# EAGLE design v7Ardustat_details (EAGLE 5.11)
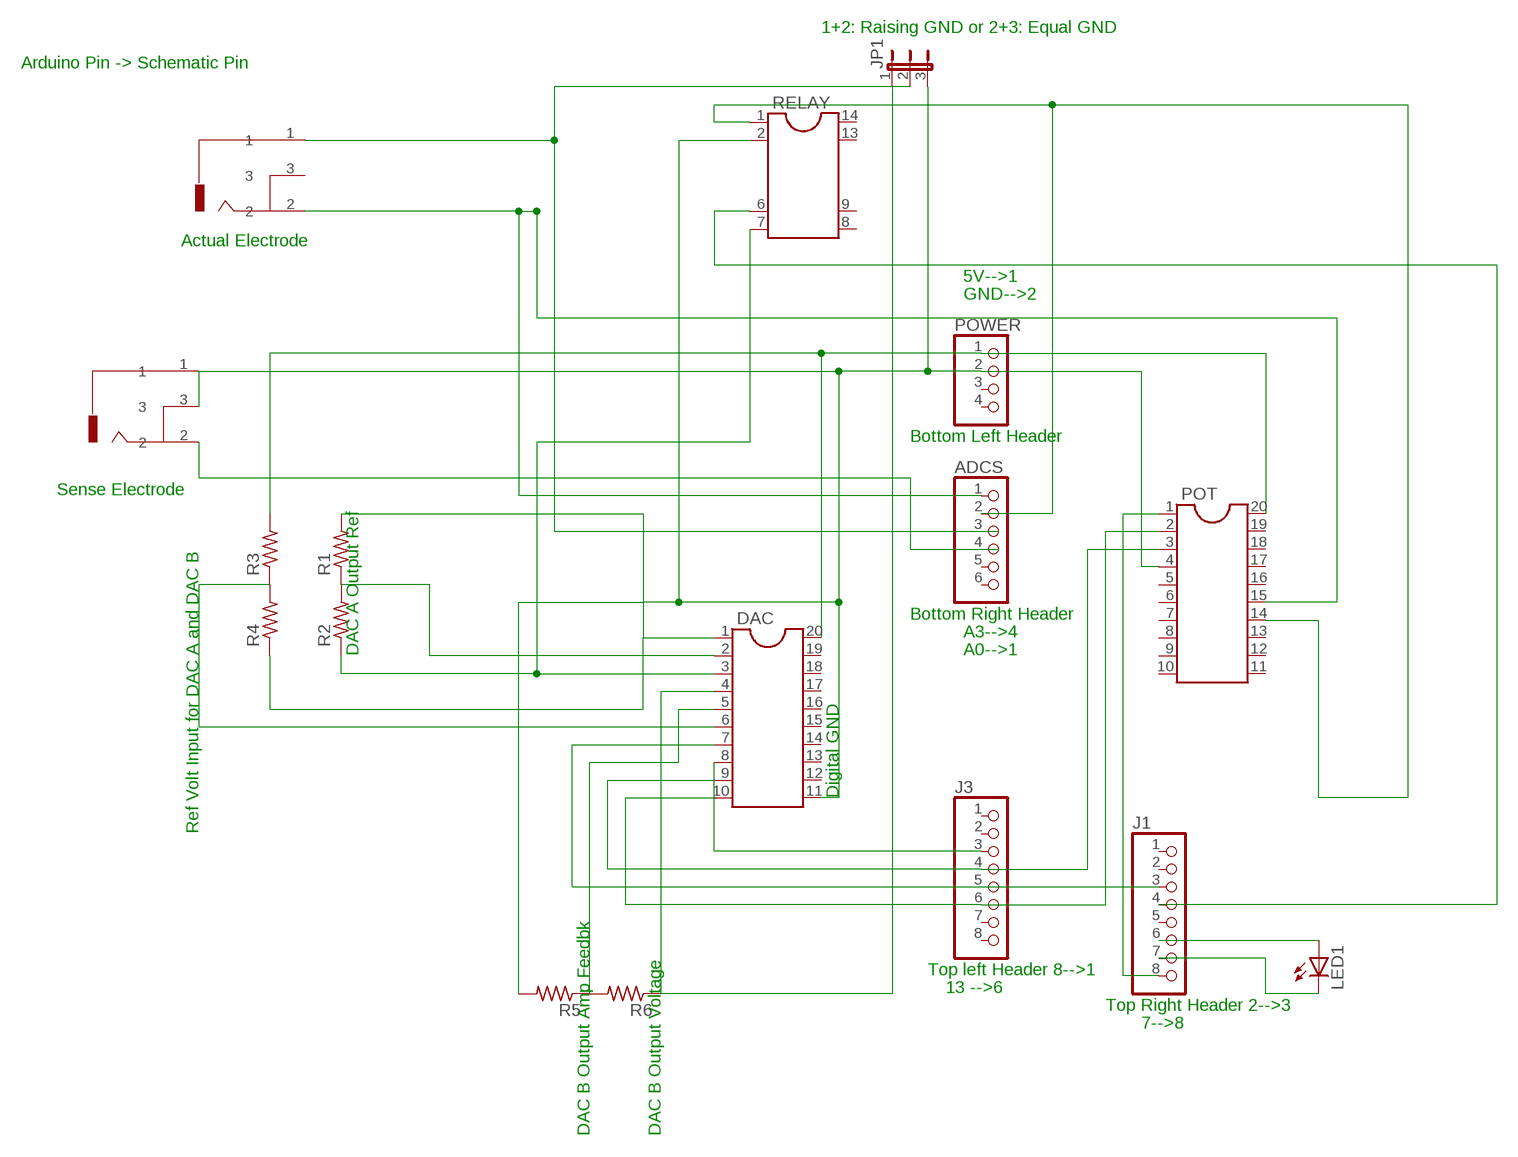
[diagram p0: schematic, sheet 1]

## Parts
ADCS  PINHD-1X6  [1X06]
DAC  DIL20S  [SOCKED-20]
J1  PINHD-1X8  [1X08]
J3  PINHD-1X8  [1X08]
JP1  JP2E  [JP2]
LED1  LED5MM  [LED5MM]
MJ-2506N1  MJ-2506N  [MJ-2506N]
MJ-2506N2  MJ-2506N  [MJ-2506N]
POT  DIL20S  [SOCKED-20]
POWER  PINHD-1X4  [1X04]
R1  R-US_0207/12  [0207/12]
R2  R-US_0207/12  [0207/12]
R3  R-US_0207/12  [0207/12]
R4  R-US_0207/12  [0207/12]
R5  R-US_0207/12  [0207/12]
R6  R-US_0207/12  [0207/12]
RELAY  DIL14/8  [DIL14/8]

## Nets
N$1: DAC.6 R3.1 R4.2
N$2: DAC.10 J3.6 POT.2
N$3: DAC.9 J3.4 POT.3
N$4: DAC.8 J3.3
N$5: DAC.7 J1.3
N$6: J1.4 RELAY.6
N$7: DAC.2 R1.1 R2.2
N$8: ADCS.1 MJ-2506N1.2 POT.15
N$9: J1.8 POT.1
N$10: DAC.20 POT.20 POWER.1 R3.2
N$11: ADCS.2 POT.14 RELAY.1
N$12: DAC.5 R5.1 R6.2
N$15: DAC.3 R2.1 RELAY.7
N$16: DAC.4 JP1.1 R6.1
N$17: J1.6 LED1.A
N$18: J1.7 LED1.K(C)
N$21: JP1.2 MJ-2506N1.1
N$27: DAC.1 DAC.11 JP1.3 MJ-2506N2.1 MJ-2506N2.3 POT.4 POWER.2 R1.2 R4.1 R5.2 RELAY.2
N$28: MJ-2506N2.2
Unconnected: ADCS.3 ADCS.4 ADCS.5 ADCS.6 DAC.12 DAC.13 DAC.14 DAC.15 DAC.16 DAC.17 DAC.18 DAC.19 J1.1 J1.2 J1.5 J3.1 J3.2 J3.5 J3.7 J3.8 MJ-2506N1.3 POT.5 POT.6 POT.7 POT.8 POT.9 POT.10 POT.11 POT.12 POT.13 POT.16 POT.17 POT.18 POT.19 POWER.3 POWER.4 RELAY.8 RELAY.9 RELAY.13 RELAY.14

## Notes on the sheet
- 1+2: Raising GND or 2+3: Equal GND
- Arduino Pin -> Schematic Pin
- Actual Electrode
- 5V-->1
- GND-->2
- Bottom Left Header
- Sense Electrode
- Bottom Right Header
- A3-->4
- DAC A Output Ref | A0-->1
- Digital GND
- Ref Volt Input for DAC A and DAC B
- Top left Header 8-->1
- 13 -->6
- Top Right Header 2-->3
- 7-->8
- DAC B Output Amp Feedbk | DAC B Output Voltage

## Library data of the parts
ADCS = pinhead:PINHD-1X6: PIN HEADER
DAC POT = ic-package:DIL20: Dual In Line
J1 J3 = pinhead:PINHD-1X8: PIN HEADER
JP1 = jumper:JP2E: JUMPER
LED1 = led:LED: LED OSRAM: - CHIPLED LG R971, LG N971, LY N971, LG Q971, LY Q971, LO R971, LY R971 LH N974, LH R974 LS Q976, LO Q976, LY Q976 LO Q996 - Hyper CHIPLED LW Q18S LB Q993, LB Q99A, LB R99A - SideLED LS A670, LO A670, LY A670, LG A670, LP A670 LB A673, LV A673, LT A673, LW A673 LH A674 LY A675 LS A676, LA A676, LO A676, LY A676, LW A676 LS A679, LY A679, LG A679 - Hyper Micro SIDELED® LS Y876, LA Y876, LO Y876, LY Y876 LT Y87S - SmartLED LW L88C, LW L88S LB L89C, LB L89S, LG L890 LS L89K, LO L89K, LY L89K LS L896, LA L896, LO L896, LY L896 - TOPLED LS T670, LO T670, LY T670, LG T670, LP T670 LSG T670, LSP T670, LSY T670, LOP T670, LYG T670 LG T671, LOG T671, LSG T671 LB T673, LV T673, LT T673, LW T673 LH T674 LS T676, LA T676, LO T676, LY T676, LB T676, LH T676, LSB T676, LW T676 LB T67C, LV T67C, LT T67C, LS T67K, LO T67K, LY T67K, LW E67C LS E67B, LA E67B, LO E67B, LY E67B, LB E67C, LV E67C, LT E67C LW T67C LS T679, LY T679, LG T679 LS T770, LO T770, LY T770, LG T770, LP T770 LB T773, LV T773, LT T773, LW T773 LH T774 LS E675, LA E675, LY E675, LS T675 LS T776, LA T776, LO T776, LY T776, LB T776 LHGB T686 LT T68C, LB T68C - Hyper Mini TOPLED® LB M676 - Mini TOPLED Santana® LG M470 LS M47K, LO M47K, LY M47K Source: http://www.osram.convergy.de - LUMILED® LXK2-PW12-R00, LXK2-PW12-S00, LXK2-PW14-U00, LXK2-PW14-V00 LXK2-PM12-R00, LXK2-PM12-S00, LXK2-PM14-U00 LXK2-PE12-Q00, LXK2-PE12-R00, LXK2-PE12-S00, LXK2-PE14-T00, LXK2-PE14-U00 LXK2-PB12-K00, LXK2-PB12-L00, LXK2-PB12-M00, LXK2-PB14-N00, LXK2-PB14-P00, LXK2-PB14-Q00 LXK2-PR12-L00, LXK2-PR12-M00, LXK2-PR14-Q00, LXK2-PR14-R00 LXK2-PD12-Q00, LXK2-PD12-R00, LXK2-PD12-S00 LXK2-PH12-R00, LXK2-PH12-S00 LXK2-PL12-P00, LXK2-PL12-Q00, LXK2-PL12-R00 Source: www.luxeon.com
MJ-2506N1 MJ-2506N2 = audio-mj250:MJ-2506N
POWER = pinhead:PINHD-1X4: PIN HEADER
R1-R6 = rcl:R-US_: RESISTOR, American symbol
RELAY = ic-package:DIL14/8: Dual In Line

## Board
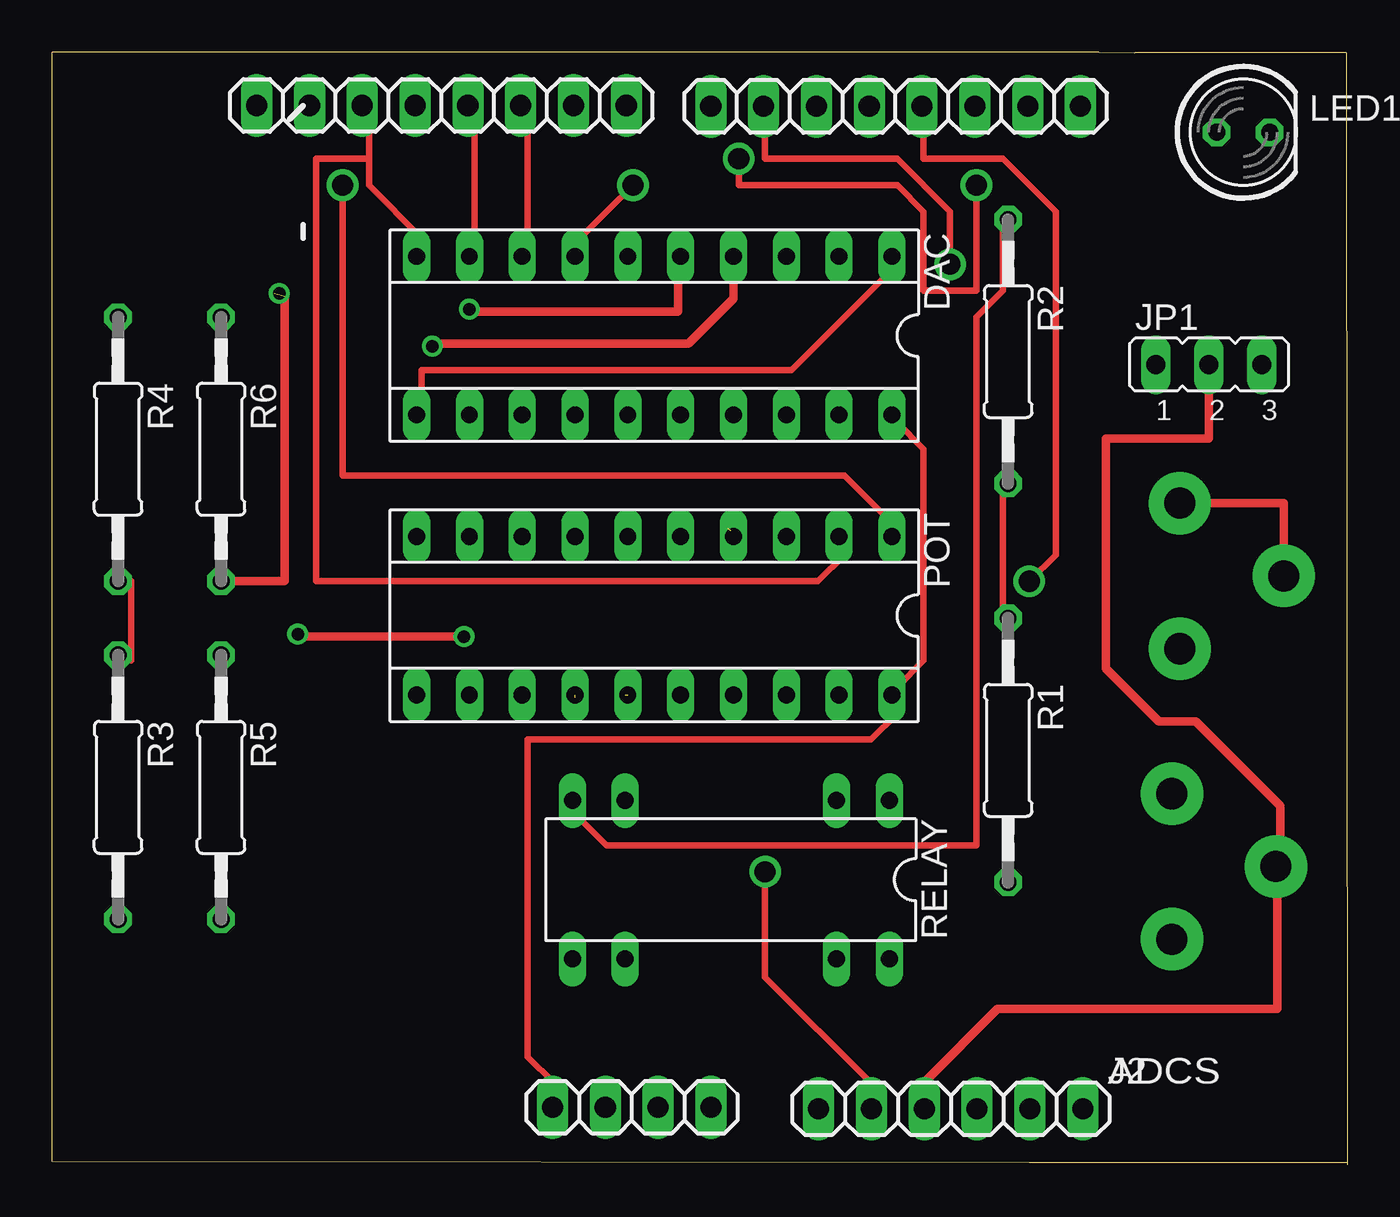
[diagram p1: board, top side]
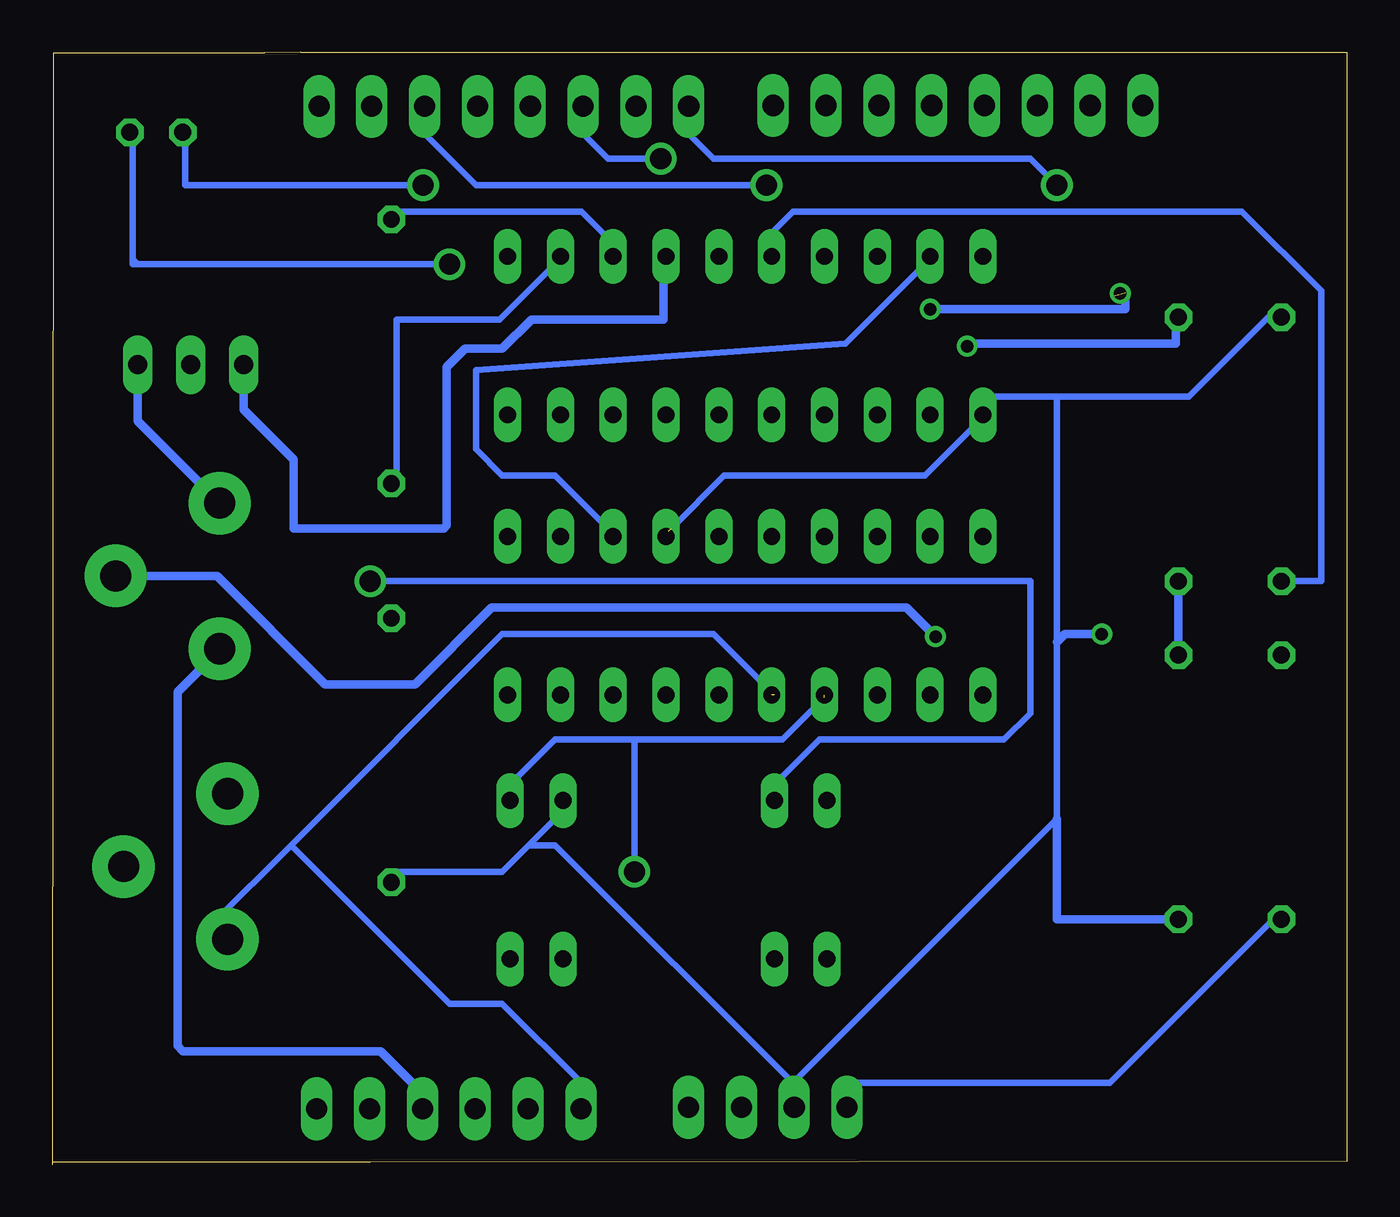
[diagram p2: board, bottom side, seen from below]

Size 62.3 x 53.5 mm. Coordinates in mm from the lower left corner, seen from the top.
Outline: 62.3,0 62.23,53.47 52.07,53.47 50.35,53.5 0,53.5 0,0.15 46.99,0.11 62.26,0.1
Copper layers (1*16): Top 0.035mm / dielectric 1.5mm / Bottom 0.035mm
Design rules "default": minimum track width 12mil, minimum drill 40mil, track to track 10mil, track to pad 10mil, pad to pad 10mil, via to via 10mil, smd to smd 10mil, copper to edge 40mil, drill to drill 8mil, minimum pad ring 10mil, minimum via ring 8mil, stop-mask expansion 4mil, vias tented up to drill 0mil, thermal gap 10mil

### Footprints (pad centres in the part's own frame; a part is rotated, then mirrored left to right if it is on the bottom)
1X06 = drill 1.016 long: 1 -6.35,0; 2 -3.81,0; 3 -1.27,0; 4 1.27,0; 5 3.81,0; 6 6.35,0
SOCKED-20 = drill 0.813 long: 1 -11.43,-3.81; 2 -8.89,-3.81; 3 -6.35,-3.81; 4 -3.81,-3.81; 5 -1.27,-3.81; 6 1.27,-3.81; 7 3.81,-3.81; 8 6.35,-3.81; 9 8.89,-3.81; 10 11.43,-3.81; 11 11.43,3.81; 12 8.89,3.81; 13 6.35,3.81; 14 3.81,3.81; 15 1.27,3.81; 16 -1.27,3.81; 17 -3.81,3.81; 18 -6.35,3.81; 19 -8.89,3.81; 20 -11.43,3.81
1X08 = drill 1.016 long: 1 -8.89,0; 2 -6.35,0; 3 -3.81,0; 4 -1.27,0; 5 1.27,0; 6 3.81,0; 7 6.35,0; 8 8.89,0
JP2 = drill 0.914 long: 1 -2.54,0; 2 0,0; 3 2.54,0
LED5MM = drill 0.813 octagon: A -1.27,0; K 1.27,0
MJ-2506N = drill 1.5 pad 3 round: 1 5,0; 2 0,-3.5; 3 0,3.5
1X04 = drill 1.016 long: 1 -3.81,0; 2 -1.27,0; 3 1.27,0; 4 3.81,0
0207/12 = drill 0.813 octagon: 1 -6.35,0; 2 6.35,0
DIL14/8 = drill 0.813 long: 1 -7.62,-3.81; 2 -5.08,-3.81; 6 5.08,-3.81; 7 7.62,-3.81; 8 7.62,3.81; 9 5.08,3.81; 13 -5.08,3.81; 14 -7.62,3.81

### Placement (x,y rotation side)
ADCS  43.21,2.68 0 top
DAC  28.96,39.86 180 top
J1  40.57,50.89 180 top
J3  18.73,50.93 180 top
JP1  55.63,38.47 0 top
LED1  57.28,49.64 0 top
MJ-2506N1  53.85,14.34 0 top
MJ-2506N2  54.23,28.31 0 top
POT  28.96,26.4 180 top
POWER  27.88,2.76 0 top
R1  45.98,19.92 270 top
R2  45.98,39.1 270 top
R3  3.18,18.15 270 top
R4  3.18,34.4 270 top
R5  8.13,18.15 270 top
R6  8.13,34.4 270 top
RELAY  32.64,13.7 180 top

### Tracks (layer width: path | path; a pad name or v marks a point on that pad's centre or on a via)
N$1
  Top 0.305: R3.1 3.81,24.24 3.81,28.05 R4.2
  Bottom 0.305: DAC.6 27.94,44.56 26.67,45.83 5.08,45.83 1.27,42.02 1.27,28.05 R4.2
N$2
  Top 0.305: 15.24,48.37 15.24,49.64 J3.6 | 15.24,48.37 15.24,47.1 17.78,44.56 DAC.10 | 15.24,48.37 12.7,48.37 12.7,28.05 36.83,28.05 38.1,29.32 POT.2
N$3
  Top 0.305: J3.4 20.32,49.64 20.32,44.56 DAC.9
  Bottom 0.305: POT.3 35.56,30.59 38.1,33.13 40.64,33.13 41.91,34.4 41.91,38.21 24.13,39.48 20.32,43.29 DAC.9
N$4
  Top 0.305: DAC.8 22.86,44.56 22.86,49.64 J3.3
N$5  (via drill 1.02)
  Top 0.305: v27.94,47.1 25.4,44.56 DAC.7
  Bottom 0.305: v27.94,47.1 41.91,47.1 44.45,49.64 J1.3
N$6  (via drill 1.02)
  Top 0.305: v46.99,28.05 48.26,29.32 48.26,45.83 45.72,48.37 41.91,48.37 41.91,49.64 J1.4
  Bottom 0.305: v46.99,28.05 15.24,28.05 15.24,21.7 16.51,20.43 25.4,20.43 27.94,17.89 RELAY.6
N$7
  Top 0.305: R1.1 45.72,26.78 45.72,33.13 R2.2
  Bottom 0.305: DAC.2 38.1,43.29 40.77,40.63 45.72,40.63 45.72,33.13 R2.2
N$8  (1 unrouted)
  Bottom 0.305: 27.56,22.59 30.48,25.51 40.64,25.51 50.8,15.35 | 50.8,15.35 54.61,11.54 MJ-2506N1.2 | 50.8,15.35 43.18,7.73 40.64,7.73 36.83,3.92 ADCS.1
N$9  (via drill 1.02)
  Top 0.305: v13.97,47.1 13.97,33.13 38.1,33.13 40.64,30.59 POT.1
  Bottom 0.305: v13.97,47.1 15.24,48.37 30.48,48.37 31.75,49.64 J1.8
N$10
  Top 0.305: DAC.20 40.64,35.67 41.91,34.4 41.91,24.24 40.64,22.97 POT.20 40.64,21.7 39.37,20.43 22.86,20.43 22.86,5.19 24.13,3.92 POWER.1
  Bottom 0.305: R3.2 3.81,11.54 11.43,3.92 24.13,3.92 POWER.1
N$11  (via drill 1.02)  (1 unrouted)
  Top 0.305: v34.29,14.08 34.29,9 39.37,3.92 ADCS.2
  Bottom 0.305: 25.15,22.46 27.18,20.43 34.29,20.43 | 34.29,20.43 38.1,20.43 40.64,17.89 RELAY.1 | v34.29,14.08 34.29,20.43
N$12  (via drill 0.6)  (1 unrouted)
  Top 0.406: R6.2 11.18,28.05 11.18,41.77 | DAC.5 30.1,43.67 30.1,41.01 20.07,41.01 v20.07,41.13
  Bottom 0.406: R5.1 R6.2 | v20.07,41.13 10.67,41.13 10.67,41.9
N$13
  Top 0.406: 59.06,14.21 58.93,14.21 58.93,7.48 45.47,7.48 42.04,4.05 42.04,2.65
N$14
  Bottom 0.406: 54.61,24.5 54.61,24.37 56.26,22.72 56.26,5.7 56.01,5.45 46.48,5.45 44.2,3.16
N$15
  Top 0.305: RELAY.7 25.4,16.62 26.67,15.35 44.45,15.35 44.45,40.75 45.72,42.02 45.72,45.83 R2.1
  Bottom 0.305: DAC.3 35.56,44.56 36.83,45.83 45.72,45.83 R2.1
N$16  (via drill 0.6)
  Top 0.406: DAC.4 32.77,41.64 30.61,39.48 18.42,39.48 v18.29,39.36
  Bottom 0.406: R6.1 8.26,40.75 8.26,39.48 18.29,39.48 v18.29,39.36 | DAC.4 32.9,43.55 32.9,40.63 39.25,40.63 40.64,39.23 42.42,39.23 43.31,38.34 43.31,30.72 43.44,30.59 50.68,30.59 50.68,33.89 53.09,36.31 JP1.1
N$17  (via drill 1.02)
  Top 0.305: v44.45,47.1 44.45,42.02 41.91,42.02 41.91,45.83 40.64,47.1 33.02,47.1 v33.02,48.37
  Bottom 0.305: v44.45,47.1 55.88,47.1 55.88,49.64 LED1.A | v33.02,48.37 35.56,48.37 36.83,49.64 J1.6
N$18  (via drill 1.02)
  Top 0.305: v43.18,43.29 43.18,45.83 40.64,48.37 34.29,48.37 34.29,49.64 J1.7
  Bottom 0.305: v43.18,43.29 58.42,43.29 | 58.42,43.29 58.3,43.42 | 58.42,43.29 58.42,49.64 LED1.K
N$20  (via drill 0.6)
  other vias: 10.92,41.9
N$21
  Top 0.406: JP1.2 55.63,34.91 50.68,34.91 50.68,23.86 53.22,21.32 54.99,21.32 59.06,17.26 59.06,14.54 MJ-2506N1.1
N$27  (via drill 0.6)  (1 unrouted)
  Top 0.305: R1.2 45.72,14.08 | DAC.1 40.64,43.29 35.56,38.21 17.78,38.21 17.78,36.94 DAC.11
  Top 0.406: MJ-2506N2.3 59.23,31.81 MJ-2506N2.1 | v19.81,25.39 11.94,25.39 v11.81,25.51
  Bottom 0.305: 39.37,15.35 40.64,14.08 45.72,14.08 R1.2 | 39.37,15.35 38.1,16.62 RELAY.2 | 26.67,3.92 38.1,15.35 39.37,15.35 | 13.97,36.94 17.78,36.94 DAC.11 17.78,35.67 20.32,33.13 29.98,33.13 32.52,30.59 | 13.97,36.94 7.62,36.94 3.81,40.75 R4.1 | 26.67,3.92 13.97,16.62 13.97,25.13 13.97,36.94 | 26.67,3.92 POWER.2
  Bottom 0.406: 32.64,30.47 32.77,30.47 POT.4 | R5.2 13.97,11.8 13.97,16.62 | MJ-2506N2.1 54.36,28.31 49.15,23.1 44.83,23.1 41.15,26.78 21.21,26.78 v19.81,25.39 | v11.81,25.51 13.59,25.51 13.97,25.13 | JP1.3 58.17,35.74 MJ-2506N2.3

### Text on the board
_tsilk: J2